# Altium schematic sheet Core.SchDoc
size A4
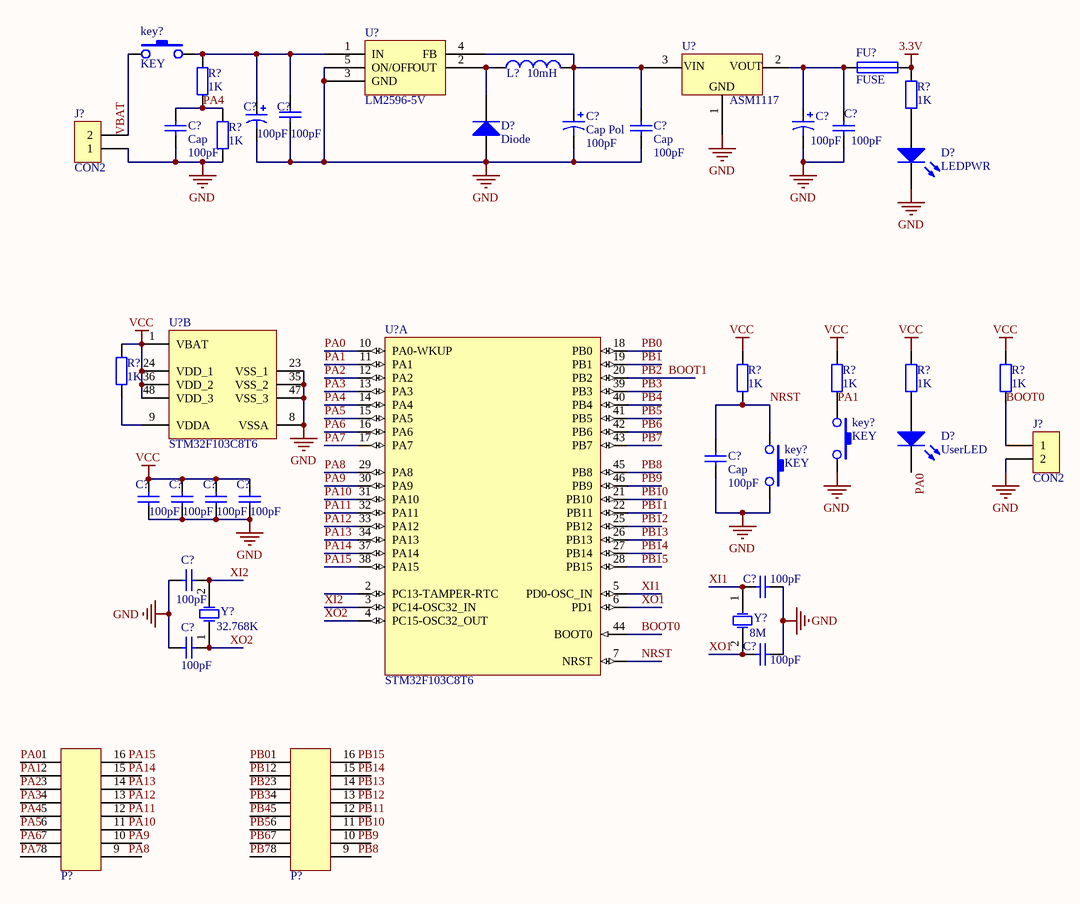
[diagram p0: Core.SchDoc]

## Parts
(Parts that share a designator on the sheet are numbered #1, #2 ... from top to bottom, then left to right.)
C?#1  value 100pF  [POLAR0.8]  (hidden comment: Cap Pol)
C?#2  value 100pF  [RAD-0.3]  (hidden comment: Cap)
C?#3  Cap Pol  value 100pF  [POLAR0.8]
C?#4  value 100pF  [POLAR0.8]  (hidden comment: Cap Pol)
C?#5  Cap  value 100pF  [RAD-0.3]
C?#6  Cap  value 100pF  [RAD-0.3]
C?#7  value 100pF  [RAD-0.3]  (hidden comment: Cap)
C?#8  Cap  value 100pF  [RAD-0.3]
C?#9  value 100pF  [RAD-0.3]  (hidden comment: Cap)
C?#10  value 100pF  [RAD-0.3]  (hidden comment: Cap)
C?#11  value 100pF  [RAD-0.3]  (hidden comment: Cap)
C?#12  value 100pF  [RAD-0.3]  (hidden comment: Cap)
C?#13  value 100pF  [RAD-0.3]  (hidden comment: Cap)
C?#14  value 100pF  [RAD-0.3]  (hidden comment: Cap)
C?#15  value 100pF  [RAD-0.3]  (hidden comment: Cap)
C?#16  value 100pF  [RAD-0.3]  (hidden comment: Cap)
D?#1  Diode  [SMC]
D?#2  LEDPWR  [LED-0]
D?#3  UserLED  [LED-0]
FU?  FUSE  [FUSE1]
J?#1  CON2  [DG1282-5.0]
J?#2  CON2  [DG1282-5.0]
key?#1  KEY  [AN12]
key?#2  KEY  [AN12]
key?#3  KEY  [AN12]
L?  value 10mH  [0402-A]  (hidden comment: Inductor)
P?#1  CON2X8  (value not drawn)
P?#2  CON2X8  (value not drawn)
R?#1  value 1K  [AXIAL-0.4]  (hidden comment: Res)
R?#2  value 1K  [AXIAL-0.4]  (hidden comment: Res)
R?#3  value 1K  [AXIAL-0.4]  (hidden comment: Res)
R?#4  value 1K  [AXIAL-0.4]  (hidden comment: Res)
R?#5  value 1K  [AXIAL-0.4]  (hidden comment: Res)
R?#6  value 1K  [AXIAL-0.4]  (hidden comment: Res)
R?#7  value 1K  [AXIAL-0.4]  (hidden comment: Res)
R?#8  value 1K  [AXIAL-0.4]  (hidden comment: Res)
U?#1  LM2596-5V
U?#2  ASM1117
U?#3  STM32F103C8T6  [LQFP48_N]  (part B of 2)
U?#4  STM32F103C8T6  [LQFP48_N]  (part A of 2)
Y?#1  value 8M  [R38]  (hidden comment: XTAL)
Y?#2  value 32.768K  [R38]  (hidden comment: XTAL)

## Nets
3.3V: FU?.2 R?#1.1
GND: C?#1.2 C?#2.1 C?#3.2 C?#4.2 C?#5.1 C?#6.1 C?#7.1 C?#8.1 C?#9.2 C?#10.2 C?#11.2 C?#12.2 C?#13.1 C?#14.1 C?#15.1 C?#16.1 D?#1.1(A) D?#2.2(K) J?#1.1 J?#2.2 key?#2.2 key?#3.2 R?#3.1 U?#1.3(GND) U?#1.5(ON/OFF) U?#2.1(GND) U?#3.8(VSSA) U?#3.23(VSS_1) U?#3.35(VSS_2) U?#3.47(VSS_3)
VCC: C?#9.1 C?#10.1 C?#11.1 C?#12.1 R?#4.1 R?#5.1 R?#6.1 R?#7.2 R?#8.2 U?#3.1(VBAT) U?#3.24(VDD_1) U?#3.36(VDD_2) U?#3.48(VDD_3)
BOOT0: J?#2.1 R?#6.2 U?#4.44(BOOT0)
BOOT1: P?#2.3 U?#4.20(PB2)  [also labelled PB2]
NRST: C?#8.2 key?#3.1 R?#8.1 U?#4.7(NRST)
PA0: D?#3.2(K) P?#1.1 U?#4.10(PA0-WKUP)
PA1: key?#2.1 P?#1.2 R?#4.2 U?#4.11(PA1)
PA2: P?#1.3 U?#4.12(PA2)
PA3: P?#1.4 U?#4.13(PA3)
PA4: C?#5.2 P?#1.5 R?#2.1 R?#3.2 U?#4.14(PA4)
PA5: P?#1.6 U?#4.15(PA5)
PA6: P?#1.7 U?#4.16(PA6)
PA7: P?#1.8 U?#4.17(PA7)
PA8: U?#4.29(PA8)
PA9: U?#4.30(PA9)
PA10: U?#4.31(PA10)
PA11: U?#4.32(PA11)
PA12: U?#4.33(PA12)
PA13: U?#4.34(PA13)
PA14: U?#4.37(PA14)
PA15: U?#4.38(PA15)
PB0: P?#2.1 U?#4.18(PB0)
PB1: P?#2.2 U?#4.19(PB1)
PB3: P?#2.4 U?#4.39(PB3)
PB4: P?#2.5 U?#4.40(PB4)
PB5: P?#2.6 U?#4.41(PB5)
PB6: P?#2.7 U?#4.42(PB6)
PB7: P?#2.8 U?#4.43(PB7)
PB8: U?#4.45(PB8)
PB9: U?#4.46(PB9)
PB10: U?#4.21(PB10)
PB11: U?#4.22(PB11)
PB12: U?#4.25(PB12)
PB13: U?#4.26(PB13)
PB14: U?#4.27(PB14)
PB15: U?#4.28(PB15)
VBAT: J?#1.2 key?#1.1
XI1: C?#14.2 U?#4.5(PD0-OSC_IN) Y?#1.1(OSC1)
XI2: C?#13.2 U?#4.3(PC14-OSC32_IN) Y?#2.2(OSC2)
XO1: C?#16.2 U?#4.6(PD1) Y?#1.2(OSC2)
XO2: C?#15.2 U?#4.4(PC15-OSC32_OUT) Y?#2.1(OSC1)
NetC?#1_1: C?#1.1 C?#2.2 key?#1.2 R?#2.2 U?#1.1(IN)
NetC?#3_1: C?#3.1 C?#6.2 L?.2 U?#1.4(FB) U?#2.3(VIN)
NetC?#4_1: C?#4.1 C?#7.2 FU?.1 U?#2.2(VOUT)
NetD?#1_2: D?#1.2(K) L?.1 U?#1.2(OUT)
NetD?#2_1: D?#2.1(A) R?#1.2
NetD?#3_1: D?#3.1(A) R?#5.2
NetR?#7_1: R?#7.1 U?#3.9(VDDA)

Not connected (* = marked no-connect by the designer): P?#1 9 10 11 12 13 14 15 16; P?#2 9 10 11 12 13 14 15 16; U?#4 2(PC13-TAMPER-RTC)

## Notes on the sheet
- Labels drawn without touching a wire or pin: PA8, PA9, PA10, PA11, PA12, PA13, PA14, PA15, PB8, PB9, PB10, PB11, PB12, PB13, PB14, PB15

## Library data of the parts
C?#1 C?#3 C?#4 = Cap Pol: Polarized Capacitor (Axial); Published: 8-Jun-2000; LatestRevisionDate: 17-Jul-2002; LatestRevisionNote: Re-released for DXP Platform.; PackageReference: POLAR0.8; Publisher: Altium Limited
C?#2 C?#5-C?#16 = Cap: Capacitor; Published: 8-Jun-2000; LatestRevisionDate: 17-Jul-2002; LatestRevisionNote: Re-released for DXP Platform.; PackageReference: RAD-0.3; Publisher: Altium Limited
D?#1 = Diode: Default Diode; Published: 8-Jun-2000; LatestRevisionDate: 17-Jul-2002; LatestRevisionNote: Re-released for DXP Platform.; PackageDocument: Sep-1996; PackageReference: SMC; Publisher: Altium Limited; Code_JEDEC: DO-214-AB
D?#2 D?#3 = LED: Typical INFRARED GaAs LED; Published: 8-Jun-2000; LatestRevisionDate: 08-Jul-2005; LatestRevisionNote: Mech Layer 1 removed.; PackageReference: LED-0; Publisher: Altium Limited
L? = Inductor: Code_IEC: 1005; Published: 8-Jun-2000; LatestRevisionDate: 17-Jul-2002; LatestRevisionNote: Re-released for DXP Platform.; PackageReference: 0402-A; Publisher: Altium Limited; Code_JEITA: 0402
R?#1-R?#8 = Res: Resistor; Published: 8-Jun-2000; LatestRevisionDate: 17-Jul-2002; LatestRevisionNote: Re-released for DXP Platform.; PackageReference: AXIAL-0.4; Publisher: Altium Limited
U?#1 = LM2596
U?#3 U?#4 = STM32F103C8T6: STM32 ARM-based 32-bit MCU Performance Line with 64 kB Flash, 20 kB Internal RAM, -40 to +85°C Temperature, 48-Pin LQFP, Tray; DatasheetVersion: rev13.0, Apr-2011; PackageVersion: rev13, Apr-2011; PackageReference: LQFP48; PackageDescription: 48-Pin Low-Profile Quad Flat Pack, 7 x 7 mm Body, 0.5 mm Pitch (LQFP48); ComponentLink1Description: Manufacturer URL; ComponentLink1URL: http://www.st.com/; ComponentLink2Description: STM32F103 Datasheet; ComponentLink2URL: http://www.st.com/internet/com/TECHNICAL_RESOURCES/TECHNICAL_LITERATURE/DATASHEET/CD00161566.pdf; ComponentLink3Description: STM32 Family Web Page; ComponentLink3URL: www.st.com/stm32
Y?#1 Y?#2 = XTAL: Crystal Oscillator; Published: 8-Jun-2000; LatestRevisionDate: 17-Jul-2002; LatestRevisionNote: Re-released for DXP Platform.; PackageReference: R38; Publisher: Altium Limited